# Altium schematic sheet NeoCortex.SchDoc: NeoCortex Alice
size A4; Organization: Altium Limited; SheetNumber: 1; SheetTotal: 5; License: CC-BY-SA 3.0; Version: 0.1; Project: NeoCortex Alice
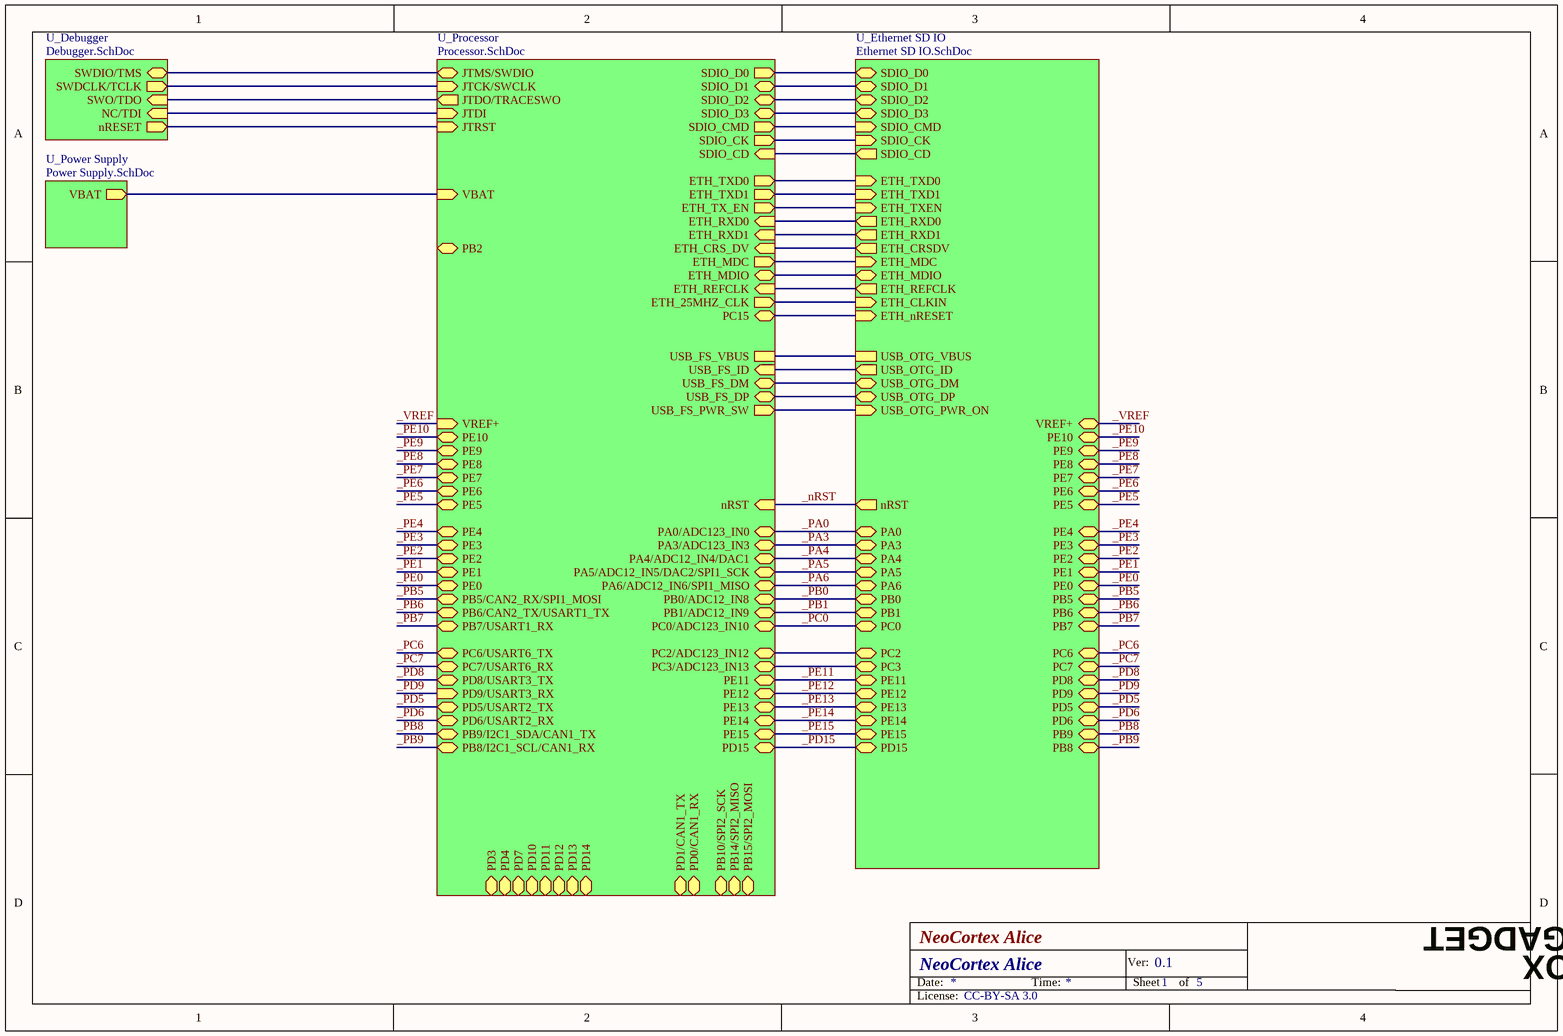
[diagram p0: NeoCortex.SchDoc]

## Sub-sheets
U_Debugger = Debugger.SchDoc: SWDIO/TMS (bidir), SWDCLK/TCLK (out), SWO/TDO (in), nRESET (out), NC/TDI (in)
U_Ethernet SD IO = Ethernet SD IO.SchDoc: ETH_MDIO (bidir), ETH_MDC (in), ETH_nRESET (in), ETH_TXEN (in), ETH_TXD0 (in), ETH_TXD1 (in), ETH_RXD0 (out), ETH_RXD1 (out), ETH_CRSDV (out), ETH_REFCLK (out), ETH_CLKIN (in), SDIO_D2 (bidir), SDIO_D3 (bidir), SDIO_D0 (bidir), SDIO_D1 (bidir), SDIO_CMD (in), SDIO_CK (in), SDIO_CD (out), USB_OTG_DM (bidir), USB_OTG_VBUS, USB_OTG_PWR_ON (in), USB_OTG_DP (bidir), USB_OTG_ID (out), nRST (out), PC2 (bidir), PC3 (bidir), PE11 (bidir), PE12 (bidir), PE13 (bidir), PE14 (bidir), PE15 (bidir), PD15 (bidir), PA0 (bidir), PA3 (bidir), PA4 (bidir), PA5 (bidir), PA6 (bidir), PB0 (bidir), PB1 (bidir), PC0 (bidir), PE0 (bidir), PE1 (bidir), PE2 (bidir), PE3 (bidir), PE4 (bidir), PE5 (bidir), PE6 (bidir), PE7 (bidir), PE8 (bidir), PE9 (bidir), PE10 (bidir), PB8 (bidir), PB9 (bidir), PD5 (bidir), PD6 (bidir), PD8 (bidir), PD9 (bidir), PC6 (bidir), PC7 (bidir), PB5 (bidir), PB6 (bidir), PB7 (bidir), VREF+ (bidir)
U_Power Supply = Power Supply.SchDoc: VBAT (out)
U_Processor = Processor.SchDoc: SDIO_CD (in), SDIO_D0 (out), SDIO_D1 (bidir), SDIO_D2 (bidir), SDIO_D3 (bidir), SDIO_CK (out), SDIO_CMD (out), USB_FS_VBUS, USB_FS_ID (in), USB_FS_DM (bidir), USB_FS_DP (bidir), ETH_25MHZ_CLK (out), ETH_REFCLK (in), ETH_MDIO (bidir), ETH_RXD0 (in), ETH_RXD1 (in), ETH_TXD0 (out), ETH_TXD1 (out), ETH_CRS_DV (in), ETH_MDC (out), ETH_TX_EN (out), PB6/CAN2_TX/USART1_TX (bidir), PB7/USART1_RX (bidir), PC6/USART6_TX (bidir), PC7/USART6_RX (bidir), PD5/USART2_TX (bidir), PD6/USART2_RX (bidir), PD8/USART3_TX (bidir), PD9/USART3_RX (in), PD1/CAN1_TX (bidir), PD0/CAN1_RX (bidir), PB10/SPI2_SCK (bidir), PB14/SPI2_MISO (bidir), PB15/SPI2_MOSI (bidir), PC0/ADC123_IN10 (bidir), PC2/ADC123_IN12 (bidir), PC3/ADC123_IN13 (bidir), PB8/I2C1_SCL/CAN1_RX (bidir), PB9/I2C1_SDA/CAN1_TX (bidir), PB5/CAN2_RX/SPI1_MOSI (bidir), PE0 (bidir), PE1 (bidir), PE2 (bidir), PE3 (bidir), PE4 (bidir), PE5 (bidir), PE6 (bidir), PE7 (bidir), PE8 (bidir), PE9 (bidir), PE10 (bidir), PE11 (bidir), PE12 (bidir), PE13 (bidir), PE14 (bidir), PE15 (bidir), PA0/ADC123_IN0 (bidir), PA3/ADC123_IN3 (bidir), PA4/ADC12_IN4/DAC1 (bidir), PA5/ADC12_IN5/DAC2/SPI1_SCK (bidir), PA6/ADC12_IN6/SPI1_MISO (bidir), PB0/ADC12_IN8 (bidir), PB1/ADC12_IN9 (bidir), USB_FS_PWR_SW (out), PD15 (bidir), JTMS/SWDIO (bidir), JTCK/SWCLK (in), JTDO/TRACESWO (out), JTRST (in), JTDI (in), PD10 (bidir), PD11 (bidir), PD12 (bidir), PD13 (bidir), PD14 (bidir), PD7 (bidir), PD3 (bidir), PD4 (bidir), PC15 (bidir), PB2 (bidir), VREF+ (in), nRST (in), VBAT (in)

## Nets
_nRST: sheet U_Ethernet SD IO/nRST, sheet U_Processor/nRST
_PA0: sheet U_Ethernet SD IO/PA0, sheet U_Processor/PA0/ADC123_IN0
_PA3: sheet U_Ethernet SD IO/PA3, sheet U_Processor/PA3/ADC123_IN3
_PA4: sheet U_Ethernet SD IO/PA4, sheet U_Processor/PA4/ADC12_IN4/DAC1
_PA5: sheet U_Ethernet SD IO/PA5, sheet U_Processor/PA5/ADC12_IN5/DAC2/SPI1_SCK
_PA6: sheet U_Ethernet SD IO/PA6, sheet U_Processor/PA6/ADC12_IN6/SPI1_MISO
_PB0: sheet U_Ethernet SD IO/PB0, sheet U_Processor/PB0/ADC12_IN8
_PB1: sheet U_Ethernet SD IO/PB1, sheet U_Processor/PB1/ADC12_IN9
_PB5: sheet U_Ethernet SD IO/PB5, sheet U_Processor/PB5/CAN2_RX/SPI1_MOSI
_PB6: sheet U_Ethernet SD IO/PB6, sheet U_Processor/PB6/CAN2_TX/USART1_TX
_PB7: sheet U_Ethernet SD IO/PB7, sheet U_Processor/PB7/USART1_RX
_PB8: sheet U_Ethernet SD IO/PB9, sheet U_Processor/PB9/I2C1_SDA/CAN1_TX
_PB9: sheet U_Ethernet SD IO/PB8, sheet U_Processor/PB8/I2C1_SCL/CAN1_RX
_PC0: sheet U_Ethernet SD IO/PC0, sheet U_Processor/PC0/ADC123_IN10
_PC6: sheet U_Ethernet SD IO/PC6, sheet U_Processor/PC6/USART6_TX
_PC7: sheet U_Ethernet SD IO/PC7, sheet U_Processor/PC7/USART6_RX
_PD5: sheet U_Ethernet SD IO/PD5, sheet U_Processor/PD5/USART2_TX
_PD6: sheet U_Ethernet SD IO/PD6, sheet U_Processor/PD6/USART2_RX
_PD8: sheet U_Ethernet SD IO/PD8, sheet U_Processor/PD8/USART3_TX
_PD9: sheet U_Ethernet SD IO/PD9, sheet U_Processor/PD9/USART3_RX
_PD15: sheet U_Ethernet SD IO/PD15, sheet U_Processor/PD15
_PE0: sheet U_Ethernet SD IO/PE0, sheet U_Processor/PE0
_PE1: sheet U_Ethernet SD IO/PE1, sheet U_Processor/PE1
_PE2: sheet U_Ethernet SD IO/PE2, sheet U_Processor/PE2
_PE3: sheet U_Ethernet SD IO/PE3, sheet U_Processor/PE3
_PE4: sheet U_Ethernet SD IO/PE4, sheet U_Processor/PE4
_PE5: sheet U_Ethernet SD IO/PE5, sheet U_Processor/PE5
_PE6: sheet U_Ethernet SD IO/PE6, sheet U_Processor/PE6
_PE7: sheet U_Ethernet SD IO/PE7, sheet U_Processor/PE7
_PE8: sheet U_Ethernet SD IO/PE8, sheet U_Processor/PE8
_PE9: sheet U_Ethernet SD IO/PE9, sheet U_Processor/PE9
_PE10: sheet U_Ethernet SD IO/PE10, sheet U_Processor/PE10
_PE11: sheet U_Ethernet SD IO/PE11, sheet U_Processor/PE11
_PE12: sheet U_Ethernet SD IO/PE12, sheet U_Processor/PE12
_PE13: sheet U_Ethernet SD IO/PE13, sheet U_Processor/PE13
_PE14: sheet U_Ethernet SD IO/PE14, sheet U_Processor/PE14
_PE15: sheet U_Ethernet SD IO/PE15, sheet U_Processor/PE15
_VREF: sheet U_Ethernet SD IO/VREF+, sheet U_Processor/VREF+
(unnamed): sheet U_Power Supply/VBAT, sheet U_Processor/VBAT
(unnamed): sheet U_Debugger/SWDIO/TMS, sheet U_Processor/JTMS/SWDIO
(unnamed): sheet U_Debugger/SWDCLK/TCLK, sheet U_Processor/JTCK/SWCLK
(unnamed): sheet U_Debugger/SWO/TDO, sheet U_Processor/JTDO/TRACESWO
(unnamed): sheet U_Debugger/nRESET, sheet U_Processor/JTRST
(unnamed): sheet U_Debugger/NC/TDI, sheet U_Processor/JTDI
(unnamed): sheet U_Ethernet SD IO/ETH_MDIO, sheet U_Processor/ETH_MDIO
(unnamed): sheet U_Ethernet SD IO/ETH_MDC, sheet U_Processor/ETH_MDC
(unnamed): sheet U_Ethernet SD IO/ETH_nRESET, sheet U_Processor/PC15
(unnamed): sheet U_Ethernet SD IO/ETH_TXEN, sheet U_Processor/ETH_TX_EN
(unnamed): sheet U_Ethernet SD IO/ETH_TXD0, sheet U_Processor/ETH_TXD0
(unnamed): sheet U_Ethernet SD IO/ETH_TXD1, sheet U_Processor/ETH_TXD1
(unnamed): sheet U_Ethernet SD IO/ETH_RXD0, sheet U_Processor/ETH_RXD0
(unnamed): sheet U_Ethernet SD IO/ETH_RXD1, sheet U_Processor/ETH_RXD1
(unnamed): sheet U_Ethernet SD IO/ETH_CRSDV, sheet U_Processor/ETH_CRS_DV
(unnamed): sheet U_Ethernet SD IO/ETH_REFCLK, sheet U_Processor/ETH_REFCLK
(unnamed): sheet U_Ethernet SD IO/ETH_CLKIN, sheet U_Processor/ETH_25MHZ_CLK
(unnamed): sheet U_Ethernet SD IO/SDIO_D2, sheet U_Processor/SDIO_D2
(unnamed): sheet U_Ethernet SD IO/SDIO_D3, sheet U_Processor/SDIO_D3
(unnamed): sheet U_Ethernet SD IO/SDIO_D0, sheet U_Processor/SDIO_D0
(unnamed): sheet U_Ethernet SD IO/SDIO_D1, sheet U_Processor/SDIO_D1
(unnamed): sheet U_Ethernet SD IO/SDIO_CMD, sheet U_Processor/SDIO_CMD
(unnamed): sheet U_Ethernet SD IO/SDIO_CK, sheet U_Processor/SDIO_CK
(unnamed): sheet U_Ethernet SD IO/SDIO_CD, sheet U_Processor/SDIO_CD
(unnamed): sheet U_Ethernet SD IO/USB_OTG_DM, sheet U_Processor/USB_FS_DM
(unnamed): sheet U_Ethernet SD IO/USB_OTG_VBUS, sheet U_Processor/USB_FS_VBUS
(unnamed): sheet U_Ethernet SD IO/USB_OTG_PWR_ON, sheet U_Processor/USB_FS_PWR_SW
(unnamed): sheet U_Ethernet SD IO/USB_OTG_DP, sheet U_Processor/USB_FS_DP
(unnamed): sheet U_Ethernet SD IO/USB_OTG_ID, sheet U_Processor/USB_FS_ID
(unnamed): sheet U_Ethernet SD IO/PC2, sheet U_Processor/PC2/ADC123_IN12
(unnamed): sheet U_Ethernet SD IO/PC3, sheet U_Processor/PC3/ADC123_IN13

## Notes on the sheet
- Date:
- Time:
- Ver:
- Sheet
- of
- GADGET
- SANDBOX
- License: